# EAGLE schematic Galaksija keyboard matrix (EAGLE 9.6.2)
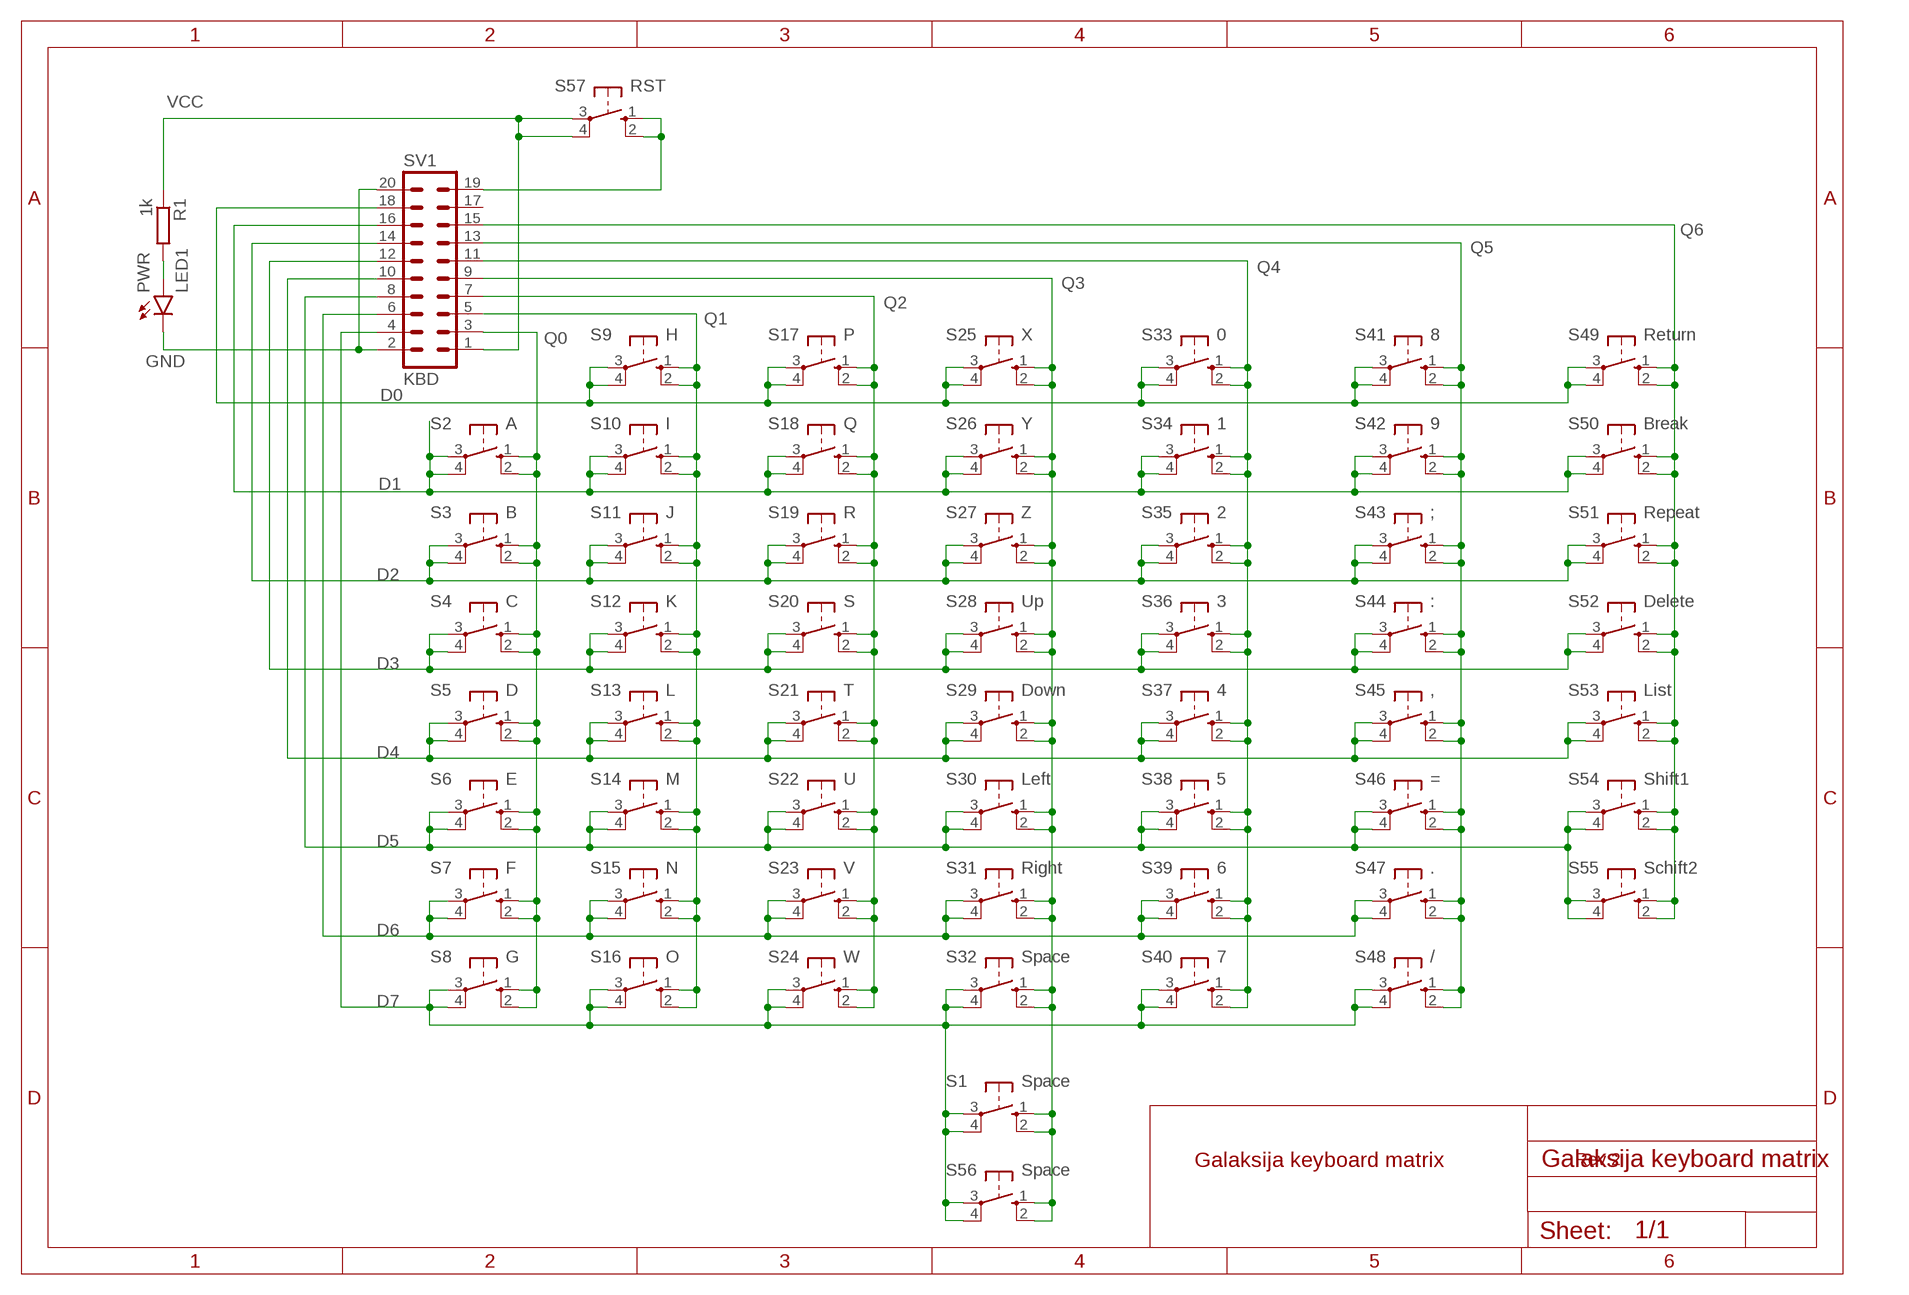
[diagram p0: schematic, sheet 1]

## Parts
LED1  PWR  LED5MM  [LED5MM]
R1  1k  R-EU_0207/10  [0207/10]
S1  Space  40-XX  [B3F-40XX]
S2  A  40-XX  [B3F-40XX]
S3  B  40-XX  [B3F-40XX]
S4  C  40-XX  [B3F-40XX]
S5  D  40-XX  [B3F-40XX]
S6  E  40-XX  [B3F-40XX]
S7  F  40-XX  [B3F-40XX]
S8  G  40-XX  [B3F-40XX]
S9  H  40-XX  [B3F-40XX]
S10  I  40-XX  [B3F-40XX]
S11  J  40-XX  [B3F-40XX]
S12  K  40-XX  [B3F-40XX]
S13  L  40-XX  [B3F-40XX]
S14  M  40-XX  [B3F-40XX]
S15  N  40-XX  [B3F-40XX]
S16  O  40-XX  [B3F-40XX]
S17  P  40-XX  [B3F-40XX]
S18  Q  40-XX  [B3F-40XX]
S19  R  40-XX  [B3F-40XX]
S20  S  40-XX  [B3F-40XX]
S21  T  40-XX  [B3F-40XX]
S22  U  40-XX  [B3F-40XX]
S23  V  40-XX  [B3F-40XX]
S24  W  40-XX  [B3F-40XX]
S25  X  40-XX  [B3F-40XX]
S26  Y  40-XX  [B3F-40XX]
S27  Z  40-XX  [B3F-40XX]
S28  Up  40-XX  [B3F-40XX]
S29  Down  40-XX  [B3F-40XX]
S30  Left  40-XX  [B3F-40XX]
S31  Right  40-XX  [B3F-40XX]
S32  Space  40-XX  [B3F-40XX]
S33  0  40-XX  [B3F-40XX]
S34  1  40-XX  [B3F-40XX]
S35  2  40-XX  [B3F-40XX]
S36  3  40-XX  [B3F-40XX]
S37  4  40-XX  [B3F-40XX]
S38  5  40-XX  [B3F-40XX]
S39  6  40-XX  [B3F-40XX]
S40  7  40-XX  [B3F-40XX]
S41  8  40-XX  [B3F-40XX]
S42  9  40-XX  [B3F-40XX]
S43  ;  40-XX  [B3F-40XX]
S44  :  40-XX  [B3F-40XX]
S45  ,  40-XX  [B3F-40XX]
S46  =  40-XX  [B3F-40XX]
S47  .  40-XX  [B3F-40XX]
S48  /  40-XX  [B3F-40XX]
S49  Return  40-XX  [B3F-40XX]
S50  Break  40-XX  [B3F-40XX]
S51  Repeat  40-XX  [B3F-40XX]
S52  Delete  40-XX  [B3F-40XX]
S53  List  40-XX  [B3F-40XX]
S54  Shift1  40-XX  [B3F-40XX]
S55  Schift2  40-XX  [B3F-40XX]
S56  Space  40-XX  [B3F-40XX]
S57  RST  40-XX  [B3F-40XX]
SV1  KBD  ML20  [ML20]

## Nets
D0: S9.3(P) S9.4(P1) S17.3(P) S17.4(P1) S25.3(P) S25.4(P1) S33.3(P) S33.4(P1) S41.3(P) S41.4(P1) S49.3(P) S49.4(P1) SV1.18
D1: S2.3(P) S2.4(P1) S10.3(P) S10.4(P1) S18.3(P) S18.4(P1) S26.3(P) S26.4(P1) S34.3(P) S34.4(P1) S42.3(P) S42.4(P1) S50.3(P) S50.4(P1) SV1.16
D2: S3.3(P) S3.4(P1) S11.3(P) S11.4(P1) S19.3(P) S19.4(P1) S27.3(P) S27.4(P1) S35.3(P) S35.4(P1) S43.3(P) S43.4(P1) S51.3(P) S51.4(P1) SV1.14
D3: S4.3(P) S4.4(P1) S12.3(P) S12.4(P1) S20.3(P) S20.4(P1) S28.3(P) S28.4(P1) S36.3(P) S36.4(P1) S44.3(P) S44.4(P1) S52.3(P) S52.4(P1) SV1.12
D4: S5.3(P) S5.4(P1) S13.3(P) S13.4(P1) S21.3(P) S21.4(P1) S29.3(P) S29.4(P1) S37.3(P) S37.4(P1) S45.3(P) S45.4(P1) S53.3(P) S53.4(P1) SV1.10
D5: S6.3(P) S6.4(P1) S14.3(P) S14.4(P1) S22.3(P) S22.4(P1) S30.3(P) S30.4(P1) S38.3(P) S38.4(P1) S46.3(P) S46.4(P1) S54.3(P) S54.4(P1) S55.3(P) S55.4(P1) SV1.8
D6: S7.3(P) S7.4(P1) S15.3(P) S15.4(P1) S23.3(P) S23.4(P1) S31.3(P) S31.4(P1) S39.3(P) S39.4(P1) S47.3(P) S47.4(P1) SV1.6
D7: S1.3(P) S1.4(P1) S8.3(P) S8.4(P1) S16.3(P) S16.4(P1) S24.3(P) S24.4(P1) S32.3(P) S32.4(P1) S40.3(P) S40.4(P1) S48.3(P) S48.4(P1) S56.3(P) S56.4(P1) SV1.4
GND: LED1.K(C) SV1.2 SV1.20
N$1: LED1.A R1.2
Q0: S2.1(S) S2.2(S1) S3.1(S) S3.2(S1) S4.1(S) S4.2(S1) S5.1(S) S5.2(S1) S6.1(S) S6.2(S1) S7.1(S) S7.2(S1) S8.1(S) S8.2(S1) SV1.3
Q1: S9.1(S) S9.2(S1) S10.1(S) S10.2(S1) S11.1(S) S11.2(S1) S12.1(S) S12.2(S1) S13.1(S) S13.2(S1) S14.1(S) S14.2(S1) S15.1(S) S15.2(S1) S16.1(S) S16.2(S1) SV1.5
Q2: S17.1(S) S17.2(S1) S18.1(S) S18.2(S1) S19.1(S) S19.2(S1) S20.1(S) S20.2(S1) S21.1(S) S21.2(S1) S22.1(S) S22.2(S1) S23.1(S) S23.2(S1) S24.1(S) S24.2(S1) SV1.7
Q3: S1.1(S) S1.2(S1) S25.1(S) S25.2(S1) S26.1(S) S26.2(S1) S27.1(S) S27.2(S1) S28.1(S) S28.2(S1) S29.1(S) S29.2(S1) S30.1(S) S30.2(S1) S31.1(S) S31.2(S1) S32.1(S) S32.2(S1) S56.1(S) S56.2(S1) SV1.9
Q4: S33.1(S) S33.2(S1) S34.1(S) S34.2(S1) S35.1(S) S35.2(S1) S36.1(S) S36.2(S1) S37.1(S) S37.2(S1) S38.1(S) S38.2(S1) S39.1(S) S39.2(S1) S40.1(S) S40.2(S1) SV1.11
Q5: S41.1(S) S41.2(S1) S42.1(S) S42.2(S1) S43.1(S) S43.2(S1) S44.1(S) S44.2(S1) S45.1(S) S45.2(S1) S46.1(S) S46.2(S1) S47.1(S) S47.2(S1) S48.1(S) S48.2(S1) SV1.13
Q6: S49.1(S) S49.2(S1) S50.1(S) S50.2(S1) S51.1(S) S51.2(S1) S52.1(S) S52.2(S1) S53.1(S) S53.2(S1) S54.1(S) S54.2(S1) S55.1(S) S55.2(S1) SV1.15
RST: S57.1(S) S57.2(S1) SV1.19
VCC: R1.1 S57.3(P) S57.4(P1) SV1.1
Unconnected: SV1.17

## Notes on the sheet
- Galaksija keyboard matrix | Rev.2

## Library data of the parts
LED1 = led:LED: LED OSRAM: - CHIPLED LG R971, LG N971, LY N971, LG Q971, LY Q971, LO R971, LY R971 LH N974, LH R974 LS Q976, LO Q976, LY Q976 LO Q996 - Hyper CHIPLED LW Q18S LB Q993, LB Q99A, LB R99A - SideLED LS A670, LO A670, LY A670, LG A670, LP A670 LB A673, LV A673, LT A673, LW A673 LH A674 LY A675 LS A676, LA A676, LO A676, LY A676, LW A676 LS A679, LY A679, LG A679 - Hyper Micro SIDELED® LS Y876, LA Y876, LO Y876, LY Y876 LT Y87S - SmartLED LW L88C, LW L88S LB L89C, LB L89S, LG L890 LS L89K, LO L89K, LY L89K LS L896, LA L896, LO L896, LY L896 - TOPLED LS T670, LO T670, LY T670, LG T670, LP T670 LSG T670, LSP T670, LSY T670, LOP T670, LYG T670 LG T671, LOG T671, LSG T671 LB T673, LV T673, LT T673, LW T673 LH T674 LS T676, LA T676, LO T676, LY T676, LB T676, LH T676, LSB T676, LW T676 LB T67C, LV T67C, LT T67C, LS T67K, LO T67K, LY T67K, LW E67C LS E67B, LA E67B, LO E67B, LY E67B, LB E67C, LV E67C, LT E67C LW T67C LS T679, LY T679, LG T679 LS T770, LO T770, LY T770, LG T770, LP T770 LB T773, LV T773, LT T773, LW T773 LH T774 LS E675, LA E675, LY E675, LS T675 LS T776, LA T776, LO T776, LY T776, LB T776 LHGB T686 LT T68C, LB T68C - Hyper Mini TOPLED® LB M676 - Mini TOPLED Santana® LG M470 LS M47K, LO M47K, LY M47K Source: http://www.osram.convergy.de LUXEON: - LUMILED® LXK2-PW12-R00, LXK2-PW12-S00, LXK2-PW14-U00, LXK2-PW14-V00 LXK2-PM12-R00, LXK2-PM12-S00, LXK2-PM14-U00 LXK2-PE12-Q00, LXK2-PE12-R00, LXK2-PE12-S00, LXK2-PE14-T00, LXK2-PE14-U00 LXK2-PB12-K00, LXK2-PB12-L00, LXK2-PB12-M00, LXK2-PB14-N00, LXK2-PB14-P00, LXK2-PB14-Q00 LXK2-PR12-L00, LXK2-PR12-M00, LXK2-PR14-Q00, LXK2-PR14-R00 LXK2-PD12-Q00, LXK2-PD12-R00, LXK2-PD12-S00 LXK2-PH12-R00, LXK2-PH12-S00 LXK2-PL12-P00, LXK2-PL12-Q00, LXK2-PL12-R00 Source: www.luxeon.com KINGBRIGHT: KA-3528ASYC Source: www.kingbright.com
R1 = rcl:R-EU_: RESISTOR, European symbol; SPICEPREFIX: R
S1-S57 = switch-omron:40-XX: OMRON SWITCH; MF: OMRON COMPONENTS USA; MPN: B3F-4000; OC_FARNELL: 176434; OC_NEWARK: 36K3105
SV1 = con-harting-ml:ML20: HARTING; OC_FARNELL: unknown; OC_NEWARK: unknown